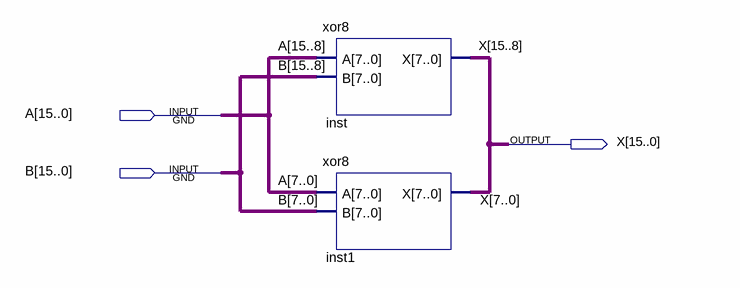
[diagram p0: schematic sheet]
// Quartus schematic xor16.bdf as structural Verilog: 2 symbols, 3 pins
module xor16 (
  input  [15:0] A,
  input  [15:0] B,
  output [15:0] X
);

  xor8 inst (.A(A[15:8]), .B(B[15:8]), .X(X[15:8]));
  xor8 inst1 (.A(A[7:0]), .B(B[7:0]), .X(X[7:0]));
endmodule
